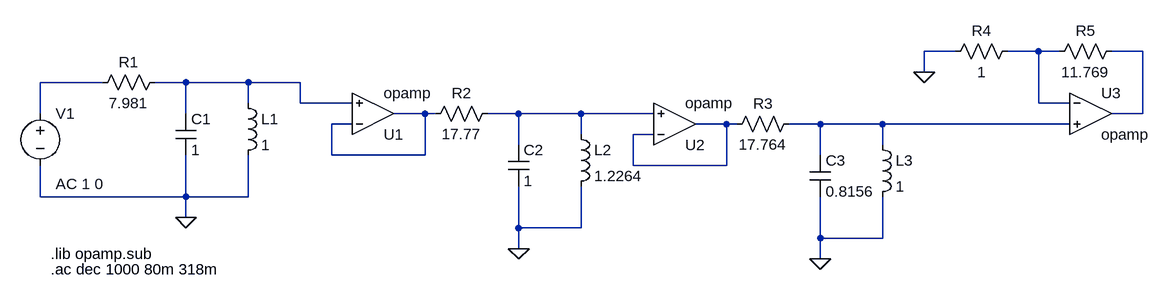
[diagram p0: schematic CircTarea4BP.asc]
CircTarea4BP.asc, the LTspice schematic file:
Version 4.1
SHEET 1 1828 680
WIRE 1360 64 1312 64
WIRE 1488 64 1440 64
WIRE 1520 64 1488 64
WIRE 1648 64 1600 64
WIRE 1312 96 1312 64
WIRE 48 112 -48 112
WIRE 176 112 128 112
WIRE 272 112 176 112
WIRE 352 112 272 112
WIRE 272 144 272 112
WIRE 352 144 352 112
WIRE 432 144 352 144
WIRE 1488 144 1488 64
WIRE 1536 144 1488 144
WIRE -48 160 -48 112
WIRE 176 160 176 112
WIRE 544 160 496 160
WIRE 560 160 544 160
WIRE 688 160 640 160
WIRE 784 160 688 160
WIRE 896 160 784 160
WIRE 1648 160 1648 64
WIRE 1648 160 1600 160
WIRE 432 176 400 176
WIRE 1008 176 960 176
WIRE 1024 176 1008 176
WIRE 1152 176 1104 176
WIRE 1248 176 1152 176
WIRE 1536 176 1248 176
WIRE 784 192 784 160
WIRE 896 192 864 192
WIRE 688 208 688 160
WIRE 1248 208 1248 176
WIRE 400 224 400 176
WIRE 544 224 544 160
WIRE 544 224 400 224
WIRE 1152 224 1152 176
WIRE 864 240 864 192
WIRE 1008 240 1008 176
WIRE 1008 240 864 240
WIRE -48 288 -48 240
WIRE 176 288 176 224
WIRE 176 288 -48 288
WIRE 272 288 272 224
WIRE 272 288 176 288
WIRE 176 320 176 288
WIRE 688 336 688 272
WIRE 784 336 784 272
WIRE 784 336 688 336
WIRE 1152 352 1152 288
WIRE 1248 352 1248 288
WIRE 1248 352 1152 352
WIRE 688 368 688 336
WIRE 1152 384 1152 352
FLAG 176 320 0
FLAG 688 368 0
FLAG 1152 384 0
FLAG 1312 96 0
SYMBOL voltage -48 144 R0
WINDOW 123 24 124 Left 2
WINDOW 39 0 0 Left 0
SYMATTR InstName V1
SYMATTR Value ""
SYMATTR Value2 AC 1 0
SYMBOL res 144 96 R90
WINDOW 0 0 56 VBottom 2
WINDOW 3 32 56 VTop 2
SYMATTR InstName R1
SYMATTR Value 7.981
SYMBOL cap 160 160 R0
SYMATTR InstName C1
SYMATTR Value 1
SYMBOL ind 256 128 R0
SYMATTR InstName L1
SYMATTR Value 1
SYMBOL OpAmps\\opamp 464 224 M180
SYMATTR InstName U1
SYMBOL res 656 144 R90
WINDOW 0 0 56 VBottom 2
WINDOW 3 32 56 VTop 2
SYMATTR InstName R2
SYMATTR Value 17.77
SYMBOL cap 672 208 R0
SYMATTR InstName C2
SYMATTR Value 1
SYMBOL ind 768 176 R0
SYMATTR InstName L2
SYMATTR Value 1.2264
SYMBOL OpAmps\\opamp 928 240 M180
SYMATTR InstName U2
SYMBOL res 1120 160 R90
WINDOW 0 0 56 VBottom 2
WINDOW 3 32 56 VTop 2
SYMATTR InstName R3
SYMATTR Value 17.764
SYMBOL cap 1136 224 R0
SYMATTR InstName C3
SYMATTR Value 0.8156
SYMBOL ind 1232 192 R0
SYMATTR InstName L3
SYMATTR Value 1
SYMBOL OpAmps\\opamp 1568 96 R0
SYMATTR InstName U3
SYMBOL res 1616 48 R90
WINDOW 0 0 56 VBottom 2
WINDOW 3 32 56 VTop 2
SYMATTR InstName R5
SYMATTR Value 11.769
SYMBOL res 1456 48 R90
WINDOW 0 0 56 VBottom 2
WINDOW 3 32 56 VTop 2
SYMATTR InstName R4
SYMATTR Value 1
TEXT -32 376 Left 2 !.lib opamp.sub
TEXT -32 400 Left 2 !.ac dec 1000 80m 318m

The netlist it stands for:
* CircTarea4BP.asc
V1 N003 0 AC 1 0
R1 N004 N003 7.981
C1 N004 0 1
L1 N004 0 1
X§U1 N005 N004 N005 opamp Aol=100K GBW=10Meg  ; pins invin noninvin out
R2 N006 N005 17.77
C2 N006 0 1
L2 N006 0 1.2264
X§U2 N007 N006 N007 opamp Aol=100K GBW=10Meg  ; pins invin noninvin out
R3 N008 N007 17.764
C3 N008 0 0.8156
L3 N008 0 1
X§U3 N001 N008 N002 opamp Aol=100K GBW=10Meg  ; pins invin noninvin out
R5 N002 N001 11.769
R4 N001 0 1
.lib opamp.sub
.ac dec 1000 80m 318m
.backanno
.end